# Altium schematic sheet XL1509-3.31_XL1509-3.3.schdoc
size 124 x 99 mm
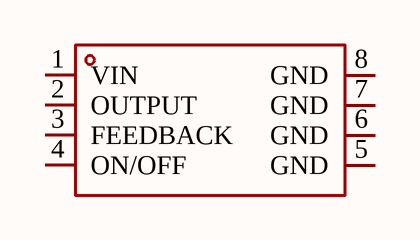
[diagram p0: XL1509-3.31_XL1509-3.3.schdoc]

## Parts
U?  XL1509-3.3  [SOIC-8_L4.9-W3.9-P1.27-LS6.0-BL]  (value not drawn)

## Nets

Not connected (* = marked no-connect by the designer): U? 1(VIN) 2(OUTPUT) 3(FEEDBACK) 4(ON/OFF) 5(GND) 6(GND) 7(GND) 8(GND)

## Library data of the parts
U? = XL1509-3.3: Manufacturer: UMW(友台半导体); Add into BOM: yes; Function: Buck; Voltage - Supply: 4.5V~40V; Output Voltage: 3.3V; Output Current: 2A; Frequency - Switching: 150kHz; Synchronous Rectifier: No; Number of Outputs: 1; Quiescent Current: 2mA; Switch tube (built-in/external): Built-In; Output Type: Fixed; Symbol: XL1509-3.3; Device: XL1509-3.3; LCSC Part Name: 150 KHz 固定频率 PWM 降压 DC/DC 转换器; Supplier Part: C2681226; Manufacturer Part: XL1509-3.3; Supplier Footprint: SOP-8; JLCPCB Part Class: Extended Part; Datasheet: https://item.szlcsc.com/datasheet/XL1509-3.3/2773702.html; Supplier: LCSC; Convert to PCB: yes; Operating Temperature: -40℃~+125℃@(TJ); Topology: Buck